# EAGLE schematic main1 (EAGLE 9.2.2)
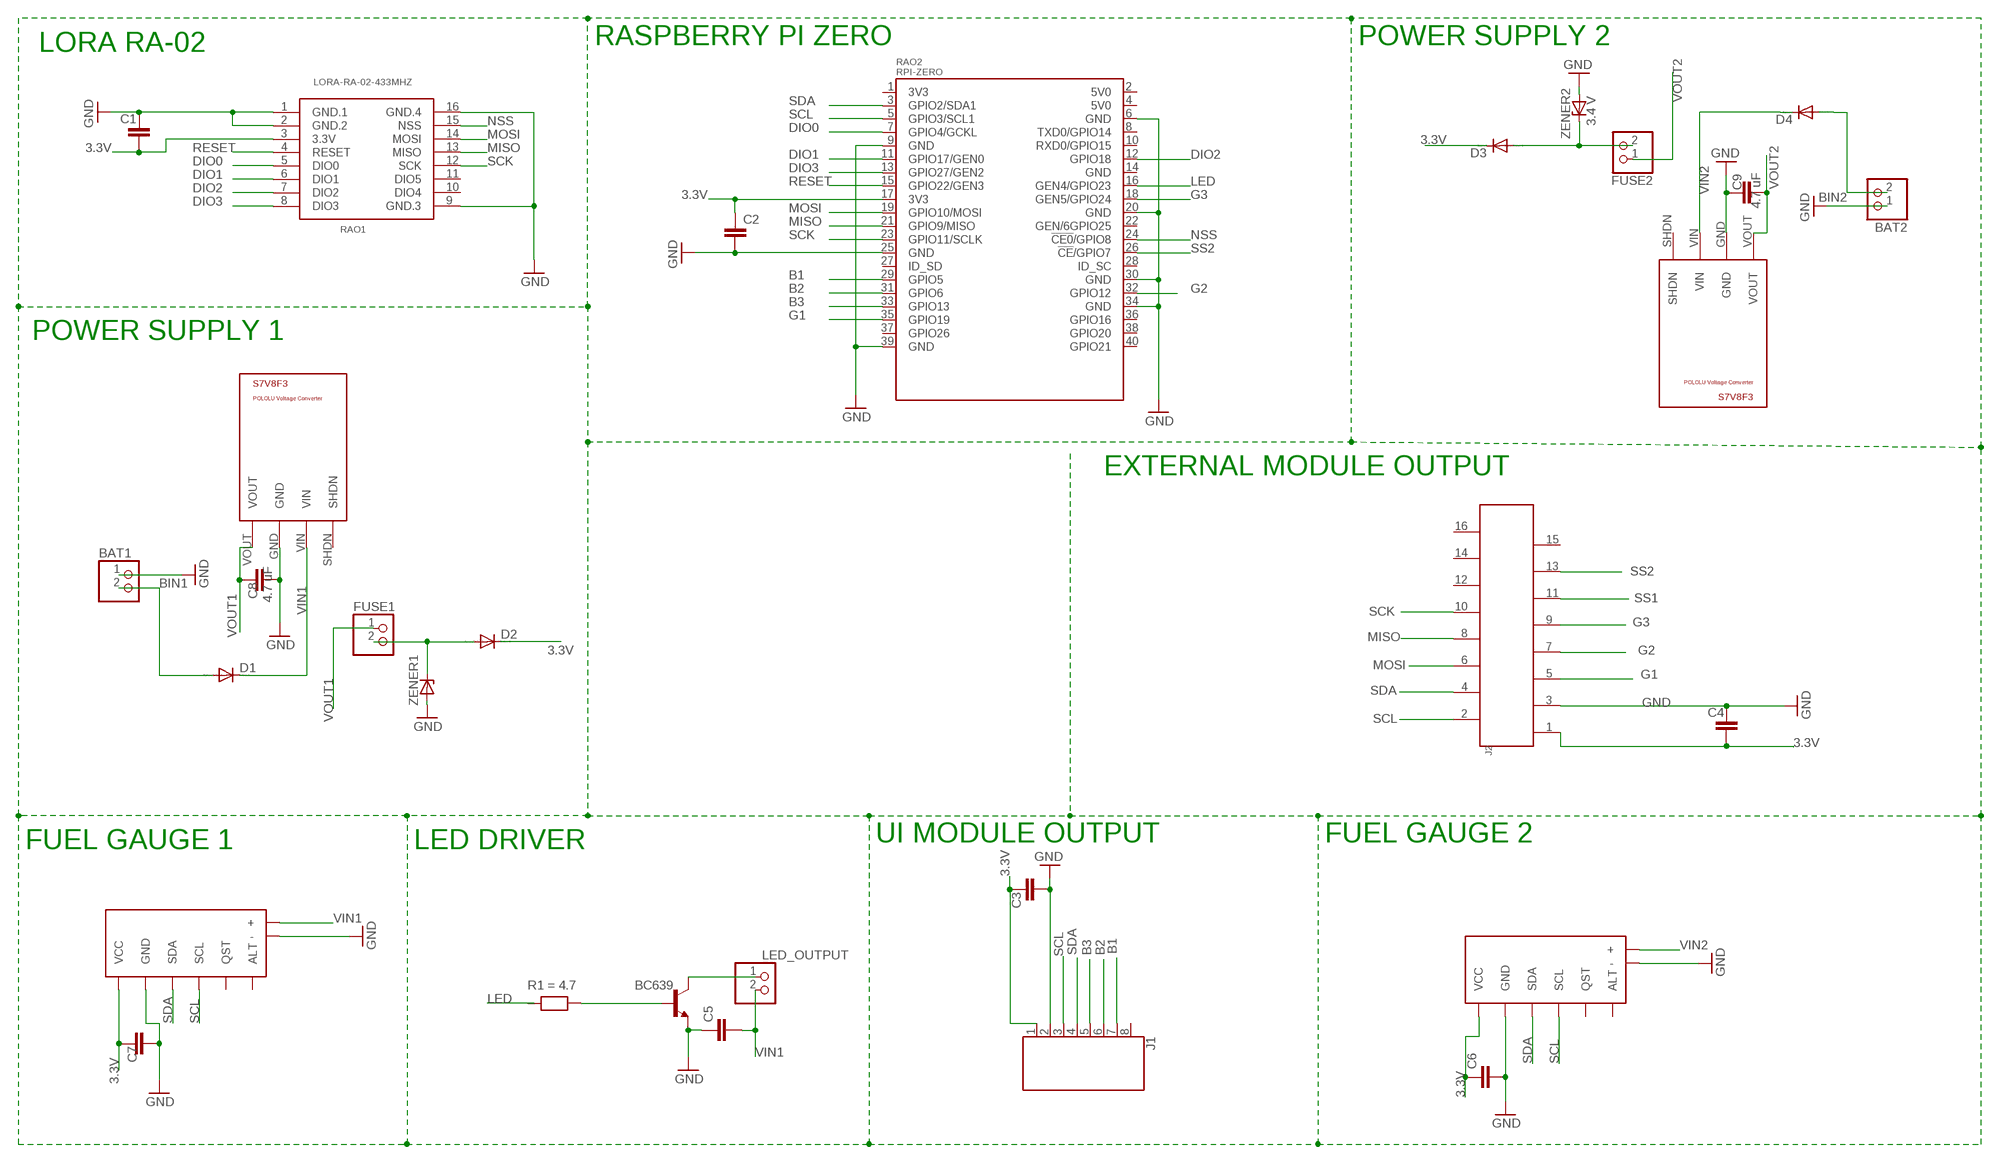
[diagram p0: schematic, sheet 1]

## Parts
BAT1  PINHD-1X2  [1X02]
BAT2  PINHD-1X2  [1X02]
BC639  BCX59SMD  [TO92-EBC]
C1  C-EUC0402  [C0402]
C2  C-EUC0402  [C0402]
C3  C-EUC0402  [C0402]
C4  C-EUC0402  [C0402]
C5  C-EUC0402  [C0402]
C6  C-EUC0402  [C0402]
C7  C-EUC0402  [C0402]
C8  4.7 uF  C-EUC0402  [C0402]
C9  4.7 uF  C-EUC0402  [C0402]
D1  CGRM4001-G  [SOD-123_MINI-SMA]
D2  CGRM4001-G  [SOD-123_MINI-SMA]
D3  CGRM4001-G  [SOD-123_MINI-SMA]
D4  CGRM4001-G  [SOD-123_MINI-SMA]
FUSE1  PINHD-1X2  [1X02]
FUSE2  PINHD-1X2  [1X02]
J1  686108183522  [686108183522]
J2  686116183822  [686116183822]
LED_OUTPUT  PINHD-1X2  [1X02]
R1  RESISTOR1206  [1206]
RAO1  LORA-RA-02-433MHZ  [LORA-RA2-SMD]
RAO2  RPI-ZERO  [RASPBERRYPI_BASTELSTUBE_V13_RASPI_BOARD_B+_FULL]
RAO3  S7V8F3  [S7V8F3]
RAO4  S7V8F3  [S7V8F3]
U$3  POLOLU_FUEL_GAUGEBREAKBOARD  [BREAKBOARD]
U$9  POLOLU_FUEL_GAUGEBREAKBOARD  [BREAKBOARD]
ZENER1  3.4 V  ZENER-DIODESMB  [SMB]
ZENER2  3.4 V  ZENER-DIODESMB  [SMB]

## Nets
3.3V: C1.2 C2.1 C3.1 C4.2 C6.1 C7.1 D2.C D3.C J1.1 J2.1 RAO1.3(3.3V) RAO2.17(3V3) U$3.VCC U$9.VCC
B1: J1.7 RAO2.29(GPIO5)
B2: J1.6 RAO2.31(GPIO6)
B3: J1.5 RAO2.33(GPIO13)
BIN1: BAT1.2 D1.A
BIN2: BAT2.2 D4.A
DIO0: RAO1.5(DIO0) RAO2.7(GPIO4/GCKL)
DIO1: RAO1.6(DIO1) RAO2.11(GPIO17/GEN0)
DIO2: RAO1.7(DIO2) RAO2.12(GPIO18)
DIO3: RAO1.8(DIO3) RAO2.13(GPIO27/GEN2)
G1: J2.5 RAO2.35(GPIO19)
G2: J2.7 RAO2.32(GPIO12)
G3: J2.9 RAO2.18(GEN5/GPIO24)
GND: BAT1.1 BAT2.1 BC639.E C1.1 C2.2 C3.2 C4.1 C5.1 C6.2 C7.2 C8.2 C9.1 J1.2 J2.3 RAO1.1(GND.1) RAO1.2(GND.2) RAO1.9(GND.3) RAO1.16(GND.4) RAO2.25(GND) RAO3.GND RAO4.GND U$3.- U$3.GND U$9.- U$9.GND ZENER1.A ZENER2.A
GND@3: RAO2.9(GND) RAO2.39(GND) ; supply symbol labelled GND
GND@8: RAO2.6(GND) RAO2.20(GND) RAO2.30(GND) RAO2.34(GND) ; supply symbol labelled GND
LED: R1.P$1 RAO2.16(GEN4/GPIO23)
MISO: J2.8 RAO1.13(MISO) RAO2.21(GPIO9/MISO)
MOSI: J2.6 RAO1.14(MOSI) RAO2.19(GPIO10/MOSI)
N$1: BC639.B R1.P$2
N$2: D3.A FUSE2.2 ZENER2.C
N$3: D2.A FUSE1.2 ZENER1.C
N$4: BC639.C LED_OUTPUT.1
NSS: RAO1.15(NSS) RAO2.24(!CE0!/GPIO8)
RESET: RAO1.4(RESET) RAO2.15(GPIO22/GEN3)
SCK: J2.10 RAO1.12(SCK) RAO2.23(GPIO11/SCLK)
SCL: J1.3 J2.2 RAO2.5(GPIO3/SCL1) U$3.SCL U$9.SCL
SDA: J1.4 J2.4 RAO2.3(GPIO2/SDA1) U$3.SDA U$9.SDA
SS1: J2.11
SS2: J2.13 RAO2.26(!CE!/GPIO7)
VIN1: C5.2 D1.C LED_OUTPUT.2 RAO3.VIN U$3.+
VIN2: D4.C RAO4.VIN U$9.+
VOUT1: C8.1 FUSE1.1 RAO3.VOUT
VOUT2: C9.2 FUSE2.1 RAO4.VOUT
Unconnected: J1.8 J2.12 J2.14 J2.15 J2.16 RAO1.10(DIO4) RAO1.11(DIO5) RAO2.1(3V3) RAO2.2(5V0) RAO2.4(5V0) RAO2.8(TXD0/GPIO14) RAO2.10(RXD0/GPIO15) RAO2.14(GND) RAO2.22(GEN/6GPIO25) RAO2.27(ID_SD) RAO2.28(ID_SC) RAO2.36(GPIO16) RAO2.37(GPIO26) RAO2.38(GPIO20) RAO2.40(GPIO21) RAO3.SHDN RAO4.SHDN U$3.ALT U$3.QST U$9.ALT U$9.QST

## Notes on the sheet
- LORA RA-02 | RASPBERRY PI ZERO | POWER SUPPLY 2
- POWER SUPPLY 1
- EXTERNAL MODULE OUTPUT
- FUEL GAUGE 1 | LED DRIVER | UI MODULE OUTPUT | FUEL GAUGE 2

## Library data of the parts
BAT1 BAT2 FUSE1 FUSE2 LED_OUTPUT = pinhead:PINHD-1X2: PIN HEADER
BC639 = transistor-npn:BCX59*: NPN Transistor
C1-C9 = rcl:C-EU: CAPACITOR, European symbol; SPICEPREFIX: C
D1-D4 = diode:CGRM400*-G: Molded plasitc,JEDEC SOD-123/Mini SMA Source: Comchip CGRM4001-G.pdf
J1 = Wurth_Elektronik_Electromechanic_FPC_Connectors_&_Flat_Flexible_Cable_rev18c:686108183522: 686108183522 WR-FPC 1.00mm SMT Horizontal Bottom Contact - Low Profile <http://katalog.we-online.de/media/images/v2/Family_WR-FPC_6861xx183522.jpg> Details see: http://katalog.we-online.de/en/em/FPC_1_00_SMT_ZIF_HORIZONTAL_BOTTOM_CONTACT_LOW_PROFILE_6861xx183522 Created by Yingchun,shan 2016 (C) Wurth Elektronik
J2 = Wurth_Elektronik_Electromechanic_FPC_Connectors_&_Flat_Flexible_Cable_rev18c:686116183822: 686116183822 WR-FPC 1.00mm SMT ZIF Vertical Type A <http://katalog.we-online.de/media/images/v2/Family_WR-FPC_6861xx183822.jpg> Details see: http://katalog.we-online.de/en/em/FPC_1_00_SMT_ZIF_VERTICAL_TYPE_A_6861xx183822 Created by Yingchun,shan 2016 (C) Wurth Elektronik
R1 = UniversalSMD:RESISTOR; R1: 4.7
RAO1 = LikeCircuit:LORA-RA-02-433MHZ: 433 MHz Lora Ra-02 Radio Transceiver Module based on SX1276 chip. Visit our more eagle PCB <https://www.likecircuit.com/>
RAO2 = RPI-Zero:RPI-ZERO
RAO3 RAO4 = POLOLU-VoltageConverter:S7V8F3
U$3 U$9 = SparFun-FuelGauge:POLOLU_FUEL_GAUGE
ZENER1 ZENER2 = diode:ZENER-DIODE: Z-Diode